# Altium schematic sheet OMC_Unit_200316.SchDoc
size A3
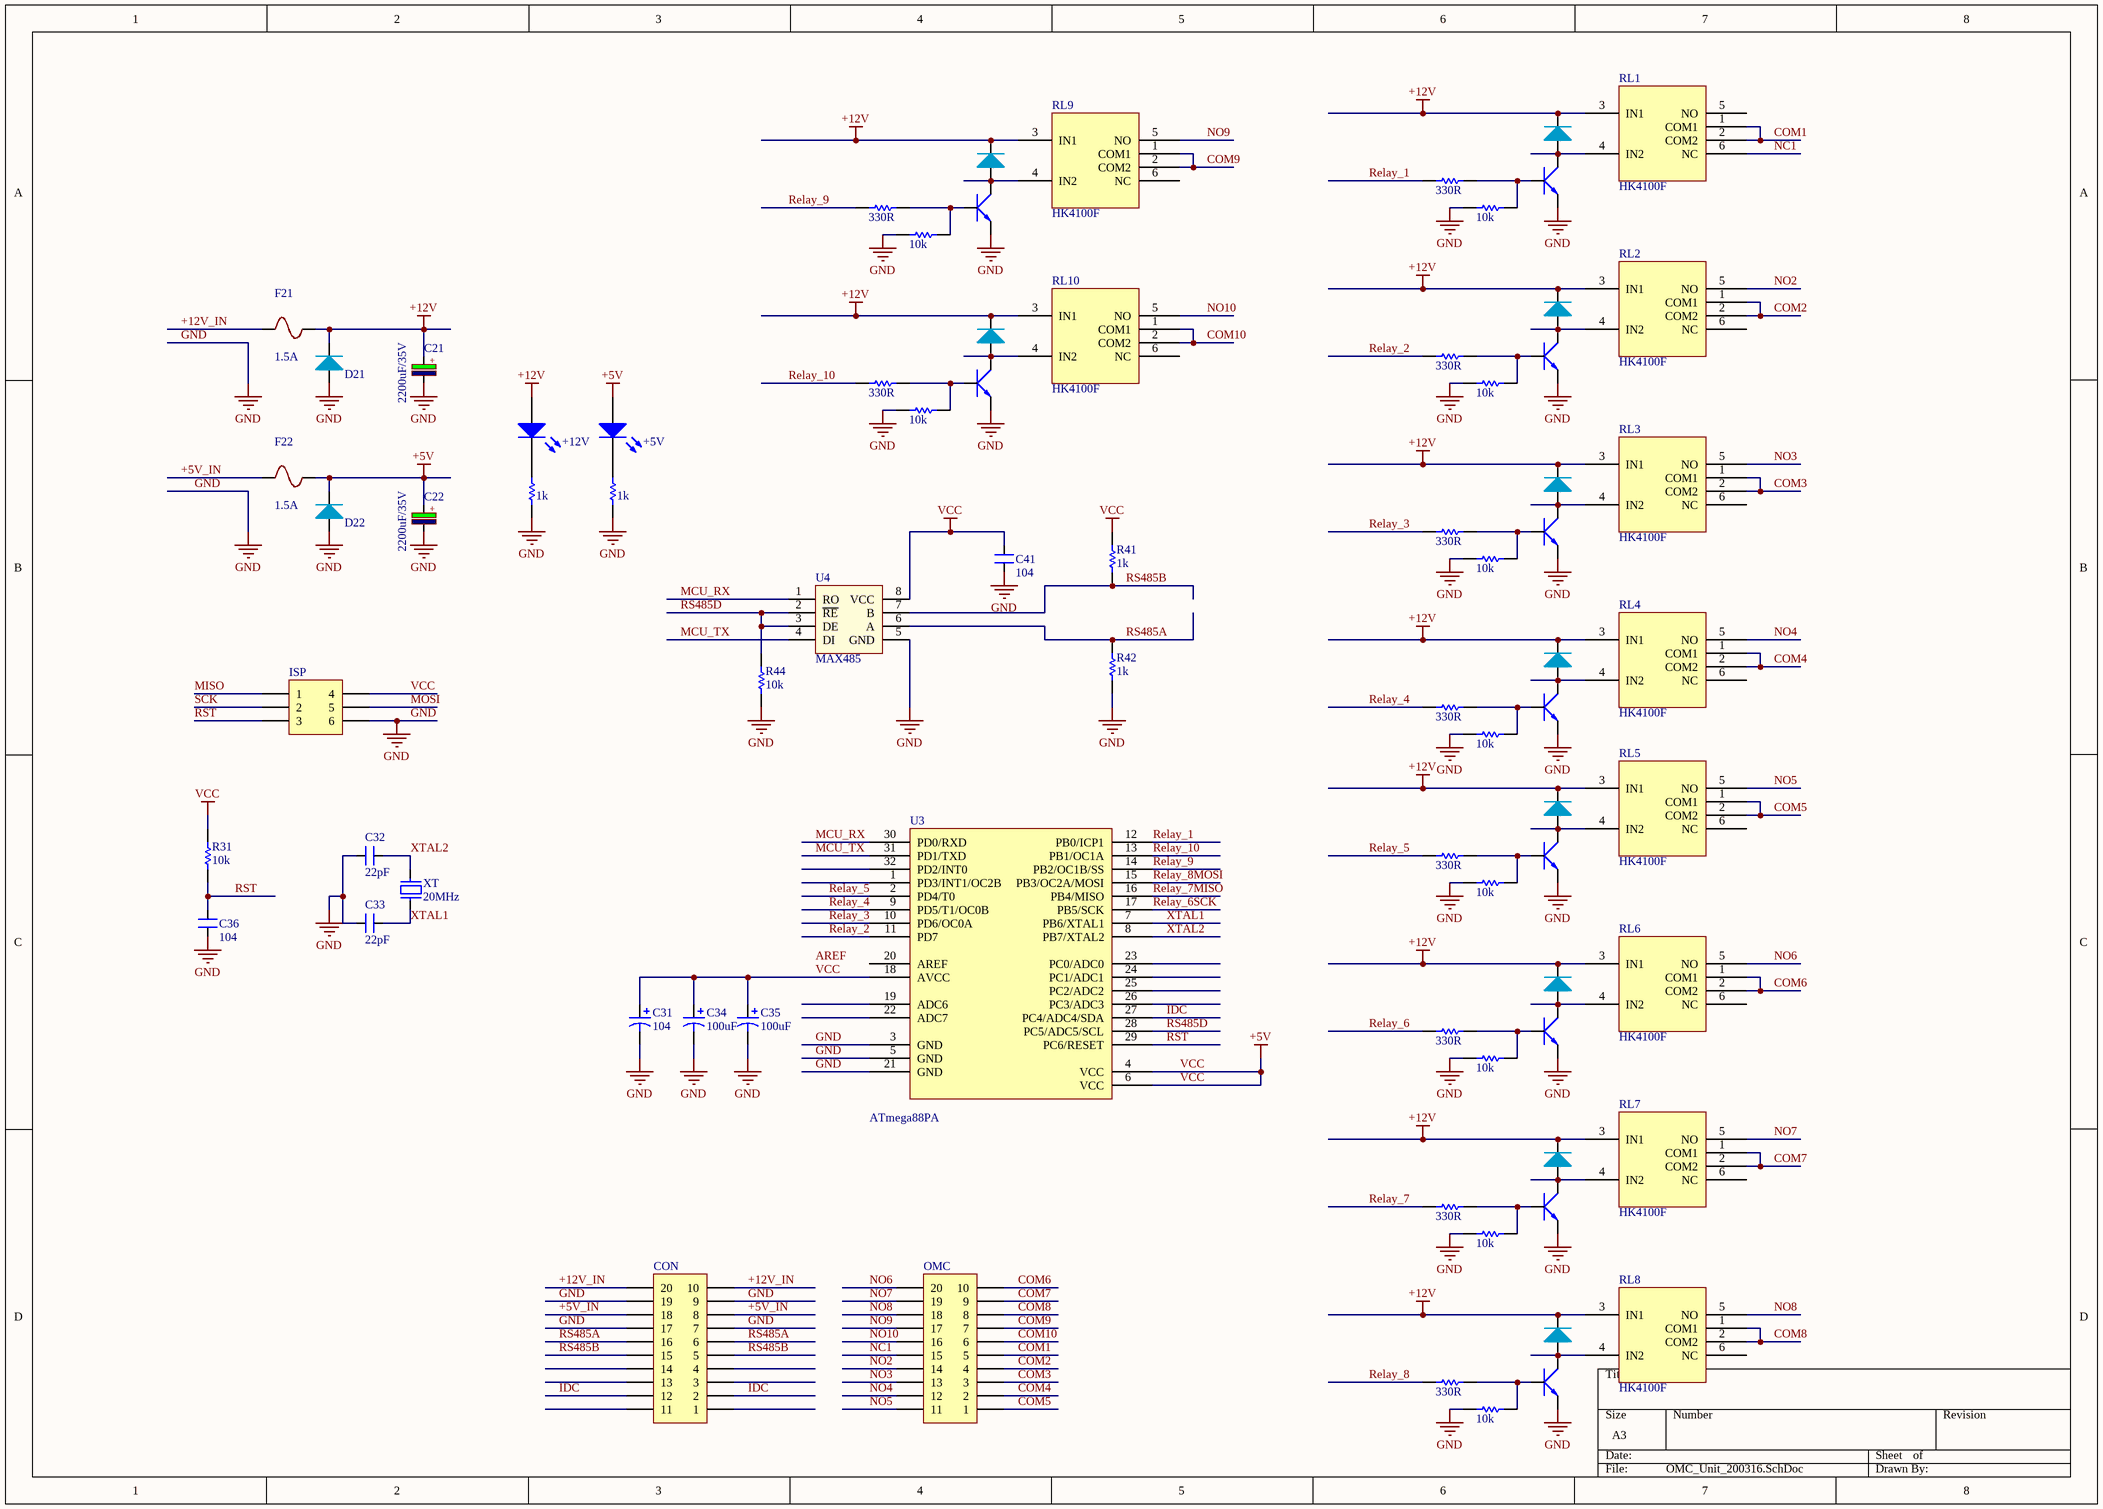
[diagram p0: OMC_Unit_200316.SchDoc]

## Parts
+5V  Led  [LED 5mm RED]  (value not drawn)
+12V  Led  [LED 5mm RED]  (value not drawn)
C21  2200uF/35V  [CAP_ELEC_SIZE_G]
C22  2200uF/35V  [CAP_ELEC_SIZE_G]
C31  value 104  [CAPC2012N_F]  (hidden comment: Cap)
C32  value 22pF  [CAPC1608N]  (hidden comment: CAP NP)
C33  value 22pF  [CAPC1608N]  (hidden comment: CAP NP)
C34  value 100uF  [CAPC2012N_F]  (hidden comment: Cap)
C35  value 100uF  [CAPC2012N_F]  (hidden comment: Cap)
C36  value 104  [CAPC1608N]  (hidden comment: CAP NP)
C41  value 104  [CAPC2012N_F]  (hidden comment: 100nF/104)
CON  Header 10X2A  [OMC10]  (value not drawn)
D21  Diode  [DO-214AC]  (value not drawn)
D22  Diode  [DO-214AC]  (value not drawn)
Do1  M7  [DO-214AC]  (value not drawn)
Do2  M7  [DO-214AC]  (value not drawn)
Do3  M7  [DO-214AC]  (value not drawn)
Do4  M7  [DO-214AC]  (value not drawn)
Do5  M7  [DO-214AC]  (value not drawn)
Do6  M7  [DO-214AC]  (value not drawn)
Do7  M7  [DO-214AC]  (value not drawn)
Do8  M7  [DO-214AC]  (value not drawn)
Do9  M7  [DO-214AC]  (value not drawn)
Do10  M7  [DO-214AC]  (value not drawn)
F21  1.5A  [FUSE_SR-5-BK]
F22  1.5A  [FUSE_SR-5-BK]
ISP  Header 3X2A  [HDR2X3_CEN]  (value not drawn)
OMC  Header 10X2A  [OMC10]  (value not drawn)
Qo1  C828  [SOT23 TOP]  (value not drawn)
Qo2  C828  [SOT23 TOP]  (value not drawn)
Qo3  C828  [SOT23 TOP]  (value not drawn)
Qo4  C828  [SOT23 TOP]  (value not drawn)
Qo5  C828  [SOT23 TOP]  (value not drawn)
Qo6  C828  [SOT23 TOP]  (value not drawn)
Qo7  C828  [SOT23 TOP]  (value not drawn)
Qo8  C828  [SOT23 TOP]  (value not drawn)
Qo9  C828  [SOT23 TOP]  (value not drawn)
Qo10  C828  [SOT23 TOP]  (value not drawn)
R21  value 1k  [RESC2012N_F]  (hidden comment: Res_0805_1k)
R22  value 1k  [RESC2012N_F]  (hidden comment: Res_0805_1k)
R31  value 10k  [RESC1608N_ZERO]  (hidden comment: Res)
R41  1k  [RESC1608N_ZERO]
R42  1k  [RESC1608N_ZERO]
R44  value 10k  [RESC1608N_ZERO]  (hidden comment: 330R)
RL1  HK4100F  [HK4100F]
RL2  HK4100F  [HK4100F]
RL3  HK4100F  [HK4100F]
RL4  HK4100F  [HK4100F]
RL5  HK4100F  [HK4100F]
RL6  HK4100F  [HK4100F]
RL7  HK4100F  [HK4100F]
RL8  HK4100F  [HK4100F]
RL9  HK4100F  [HK4100F]
RL10  HK4100F  [HK4100F]
Rp1  value 10k  [RESC1608N_ZERO]  (hidden comment: Res)
Rp2  value 10k  [RESC1608N_ZERO]  (hidden comment: Res)
Rp3  value 10k  [RESC1608N_ZERO]  (hidden comment: Res)
Rp4  value 10k  [RESC1608N_ZERO]  (hidden comment: Res)
Rp5  value 10k  [RESC1608N_ZERO]  (hidden comment: Res)
Rp6  value 10k  [RESC1608N_ZERO]  (hidden comment: Res)
Rp7  value 10k  [RESC1608N_ZERO]  (hidden comment: Res)
Rp8  value 10k  [RESC1608N_ZERO]  (hidden comment: Res)
Rp9  value 10k  [RESC1608N_ZERO]  (hidden comment: Res)
Rp10  value 10k  [RESC1608N_ZERO]  (hidden comment: Res)
Rr1  value 330R  [RESC1608N_ZERO]  (hidden comment: Res)
Rr2  value 330R  [RESC1608N_ZERO]  (hidden comment: Res)
Rr3  value 330R  [RESC1608N_ZERO]  (hidden comment: Res)
Rr4  value 330R  [RESC1608N_ZERO]  (hidden comment: Res)
Rr5  value 330R  [RESC1608N_ZERO]  (hidden comment: Res)
Rr6  value 330R  [RESC1608N_ZERO]  (hidden comment: Res)
Rr7  value 330R  [RESC1608N_ZERO]  (hidden comment: Res)
Rr8  value 330R  [RESC1608N_ZERO]  (hidden comment: Res)
Rr9  value 330R  [RESC1608N_ZERO]  (hidden comment: Res)
Rr10  value 330R  [RESC1608N_ZERO]  (hidden comment: Res)
U3  ATmega88PA  [32PIN]
U4  MAX485  [SO-8]
XT  20MHz  [XT2]

## Nets
+12V: +12V.1(A) C21.1 D21.2(K) Do1.2(K) Do2.2(K) Do3.2(K) Do4.2(K) Do5.2(K) Do6.2(K) Do7.2(K) Do8.2(K) Do9.2(K) Do10.2(K) F21.2 RL1.3(IN1) RL2.3(IN1) RL3.3(IN1) RL4.3(IN1) RL5.3(IN1) RL6.3(IN1) RL7.3(IN1) RL8.3(IN1) RL9.3(IN1) RL10.3(IN1)
GND: C21.2 C22.2 C31.2 C32.2 C33.2 C34.2 C35.2 C36.1 C41.1 CON.7 CON.9 CON.17 CON.19 D21.1(A) D22.1(A) ISP.6 Qo1.3(E) Qo2.3(E) Qo3.3(E) Qo4.3(E) Qo5.3(E) Qo6.3(E) Qo7.3(E) Qo8.3(E) Qo9.3(E) Qo10.3(E) R21.2 R22.2 R42.1 R44.1 Rp1.1 Rp2.1 Rp3.1 Rp4.1 Rp5.1 Rp6.1 Rp7.1 Rp8.1 Rp9.1 Rp10.1 U3.3(GND) U3.5(GND) U3.21(GND) U4.5(GND)
VCC: +5V.1(A) C22.1 C31.1 C34.1 C35.1 C41.2 D22.2(K) F22.2 ISP.4 R31.2 R41.2 U3.4(VCC) U3.6(VCC) U3.18(AVCC) U4.8(VCC)  [also labelled +5V]
+5V_IN: CON.8 CON.18 F22.1
+12V_IN: CON.10 CON.20 F21.1
COM1: OMC.5 RL1.1(COM1) RL1.2(COM2)
COM2: OMC.4 RL2.1(COM1) RL2.2(COM2)
COM3: OMC.3 RL3.1(COM1) RL3.2(COM2)
COM4: OMC.2 RL4.1(COM1) RL4.2(COM2)
COM5: OMC.1 RL5.1(COM1) RL5.2(COM2)
COM6: OMC.10 RL6.1(COM1) RL6.2(COM2)
COM7: OMC.9 RL7.1(COM1) RL7.2(COM2)
COM8: OMC.8 RL8.1(COM1) RL8.2(COM2)
COM9: OMC.7 RL9.1(COM1) RL9.2(COM2)
COM10: OMC.6 RL10.1(COM1) RL10.2(COM2)
IDC: CON.2 CON.12 U3.27(PC4/ADC4/SDA)
MCU_RX: U3.30(PD0/RXD) U4.1(RO)
MCU_TX: U3.31(PD1/TXD) U4.4(DI)
MISO: ISP.1 Rr7.1 U3.16(PB4/MISO)  [also labelled Relay_7]
MOSI: ISP.5 Rr8.1 U3.15(PB3/OC2A/MOSI)  [also labelled Relay_8]
NC1: OMC.15 RL1.6(NC)
NO2: OMC.14 RL2.5(NO)
NO3: OMC.13 RL3.5(NO)
NO4: OMC.12 RL4.5(NO)
NO5: OMC.11 RL5.5(NO)
NO6: OMC.20 RL6.5(NO)
NO7: OMC.19 RL7.5(NO)
NO8: OMC.18 RL8.5(NO)
NO9: OMC.17 RL9.5(NO)
NO10: OMC.16 RL10.5(NO)
Relay_1: Rr1.1 U3.12(PB0/ICP1)
Relay_2: Rr2.1 U3.11(PD7)
Relay_3: Rr3.1 U3.10(PD6/OC0A)
Relay_4: Rr4.1 U3.9(PD5/T1/OC0B)
Relay_5: Rr5.1 U3.2(PD4/T0)
Relay_6: ISP.2 Rr6.1 U3.17(PB5/SCK)  [also labelled SCK]
Relay_9: Rr9.1 U3.14(PB2/OC1B/SS)
Relay_10: Rr10.1 U3.13(PB1/OC1A)
RS485A: CON.6 CON.16 R42.2 U4.6(A)
RS485B: CON.5 CON.15 R41.1 U4.7(B)
RS485D: R44.2 U3.28(PC5/ADC5/SCL) U4.2(~{RE}) U4.3(DE)
RST: C36.2 ISP.3 R31.1 U3.29(PC6/RESET)
XTAL1: C33.1 U3.7(PB6/XTAL1) XT.1
XTAL2: C32.1 U3.8(PB7/XTAL2) XT.2
Net+5V_2: +5V.2(K) R22.1
Net+12V_2: +12V.2(K) R21.1
NetDo1_1: Do1.1(A) Qo1.2(C) RL1.4(IN2)
NetDo2_1: Do2.1(A) Qo2.2(C) RL2.4(IN2)
NetDo3_1: Do3.1(A) Qo3.2(C) RL3.4(IN2)
NetDo4_1: Do4.1(A) Qo4.2(C) RL4.4(IN2)
NetDo5_1: Do5.1(A) Qo5.2(C) RL5.4(IN2)
NetDo6_1: Do6.1(A) Qo6.2(C) RL6.4(IN2)
NetDo7_1: Do7.1(A) Qo7.2(C) RL7.4(IN2)
NetDo8_1: Do8.1(A) Qo8.2(C) RL8.4(IN2)
NetDo9_1: Do9.1(A) Qo9.2(C) RL9.4(IN2)
NetDo10_1: Do10.1(A) Qo10.2(C) RL10.4(IN2)
NetQo1_1: Qo1.1(B) Rp1.2 Rr1.2
NetQo2_1: Qo2.1(B) Rp2.2 Rr2.2
NetQo3_1: Qo3.1(B) Rp3.2 Rr3.2
NetQo4_1: Qo4.1(B) Rp4.2 Rr4.2
NetQo5_1: Qo5.1(B) Rp5.2 Rr5.2
NetQo6_1: Qo6.1(B) Rp6.2 Rr6.2
NetQo7_1: Qo7.1(B) Rp7.2 Rr7.2
NetQo8_1: Qo8.1(B) Rp8.2 Rr8.2
NetQo9_1: Qo9.1(B) Rp9.2 Rr9.2
NetQo10_1: Qo10.1(B) Rp10.2 Rr10.2

Not connected (* = marked no-connect by the designer): CON 1 3 4 11 13 14; RL1 5(NO); RL2 6(NC); RL3 6(NC); RL4 6(NC); RL5 6(NC); RL6 6(NC); RL7 6(NC); RL8 6(NC); RL9 6(NC); RL10 6(NC); U3 1(PD3/INT1/OC2B) 19(ADC6) 20(AREF) 22(ADC7) 23(PC0/ADC0) 24(PC1/ADC1) 25(PC2/ADC2) 26(PC3/ADC3) 32(PD2/INT0)

## Notes on the sheet
- Labels drawn without touching a wire or pin: AREF
- (in symbol CP4) +

## Library data of the parts
+5V +12V = Led: pin to pad: 1>A 2>K
C21 C22 = CP4: Cap 1000uF/16V - 220uF/50V; Description 5: 4,7uF>10uF/250V_3,3uF>10uF/400V - 2,2uF>4,7uF/450V; Description 1: 2200uF-3300uF/6,3V - 1000uF-2200uF/10V; Description 2: 1000uF/16V - 470uF => 1000uF/25V - 100uF/100V; Description 3: 330uF>470uF/35V_220uF>470uF/50V_10uF>22uF/250V; Description 4: 220uF => 330uF/63V - 10uF =>33uF/160 - 200V; Value: 1000uF/16V
C41 = CAP NP
CON OMC = Header 10X2A: Header, 10-Pin, Dual row; LatestRevisionDate: 17-Jul-2002; LatestRevisionNote: Re-released for DXP Platform.; Publisher: Altium Limited
D21 D22 Do1-Do10 = Diode: pin to pad: 1>A 2>K
F21 F22 = Fuse
ISP = Header 3X2A: Header, 3-Pin, Dual row; LatestRevisionDate: 17-Jul-2002; LatestRevisionNote: Re-released for DXP Platform.; Publisher: Altium Limited
Qo1-Qo10 = NPN: Transistor C828 C1815....
R21 R22 = Res
R41 R42 R44 = Res: Tro dan
  R41 R42: Value: 1k
U3 = ATmega48/168/328
U4 = MAX485: RS232 - RS485 (Same sn75176)
XT = Crystal